# Altium schematic sheet array.SchDoc
size Letter; CompanyName: Brinton Engineering, LLC; Address1: 3479 Edison Way; Address2: Menlo Park CA 94025; Address3: +1 (877) 778-8435; Address4: brintonengineering.com; Revision: 1; SheetNumber: 1; SheetTotal: 1
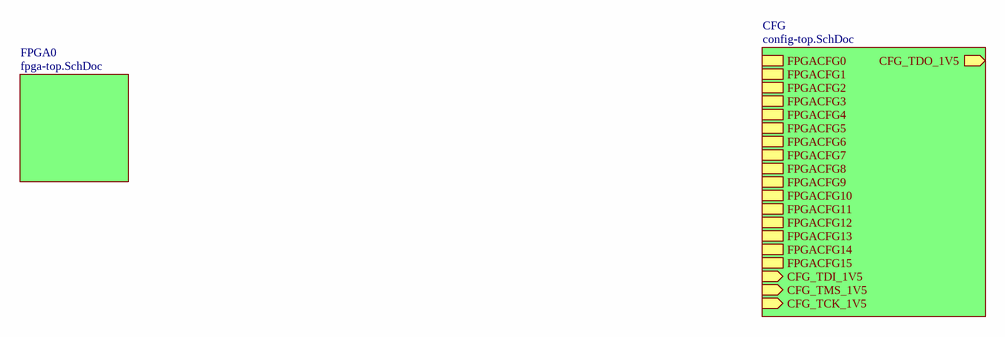
[diagram p0: array.SchDoc]

## Sub-sheets
CFG = config-top.SchDoc: FPGACFG0, FPGACFG1, FPGACFG2, FPGACFG3, FPGACFG4, FPGACFG5, FPGACFG6, FPGACFG7, FPGACFG8, FPGACFG9, FPGACFG10, FPGACFG11, FPGACFG12, FPGACFG13, FPGACFG14, FPGACFG15, CFG_TDI_1V5 (in), CFG_TMS_1V5 (in), CFG_TCK_1V5 (in), CFG_TDO_1V5 (out)
FPGA0 = fpga-top.SchDoc: no entries

## Notes on the sheet
- Title
- Engineer
- Revision
- Drawn By
- Checked By
- Date
- Sheet
- of